# EAGLE design TinyCube10_BetterLib (EAGLE 7.5.0)
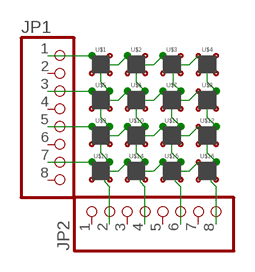
[diagram p0: schematic, sheet 1]

## Parts
JP1  PINHD-1X8BIG  [1X08-BIG]
JP2  PINHD-1X8BIG  [1X08-BIG]
U$1  PILLAR  [10MIL]
U$2  PILLAR  [10MIL]
U$3  PILLAR  [10MIL]
U$4  PILLAR  [10MIL]
U$5  PILLAR  [10MIL]
U$6  PILLAR  [10MIL]
U$7  PILLAR  [10MIL]
U$8  PILLAR  [10MIL]
U$9  PILLAR  [10MIL]
U$10  PILLAR  [10MIL]
U$11  PILLAR  [10MIL]
U$12  PILLAR  [10MIL]
U$13  PILLAR  [10MIL]
U$14  PILLAR  [10MIL]
U$15  PILLAR  [10MIL]
U$16  PILLAR  [10MIL]

## Nets
N$1: JP1.1 U$1.B U$2.B U$3.B U$4.B
N$4: JP1.7 U$13.B U$14.B U$15.B U$16.B
N$5: JP2.2 U$1.G U$5.G U$9.G U$13.G
N$6: JP2.4 U$2.G U$6.G U$10.G U$14.G
N$7: JP2.6 U$3.G U$7.G U$11.G U$15.G
N$8: JP2.8 U$4.G U$8.G U$12.G U$16.G
N$11: JP1.5 U$9.B U$10.B U$11.B U$12.B
N$26: JP1.3 U$5.B U$6.B U$7.B U$8.B
Unconnected: JP1.2 JP1.4 JP1.6 JP1.8 JP2.1 JP2.3 JP2.5 JP2.7 U$1.A U$1.R U$2.A U$2.R U$3.A U$3.R U$4.A U$4.R U$5.A U$5.R U$6.A U$6.R U$7.A U$7.R U$8.A U$8.R U$9.A U$9.R U$10.A U$10.R U$11.A U$11.R U$12.A U$12.R U$13.A U$13.R U$14.A U$14.R U$15.A U$15.R U$16.A U$16.R

## Library data of the parts
JP1 JP2 = adafruit:PINHD-1X8: PIN HEADER
U$1-U$16 = PILLAR:PILLAR

## Board
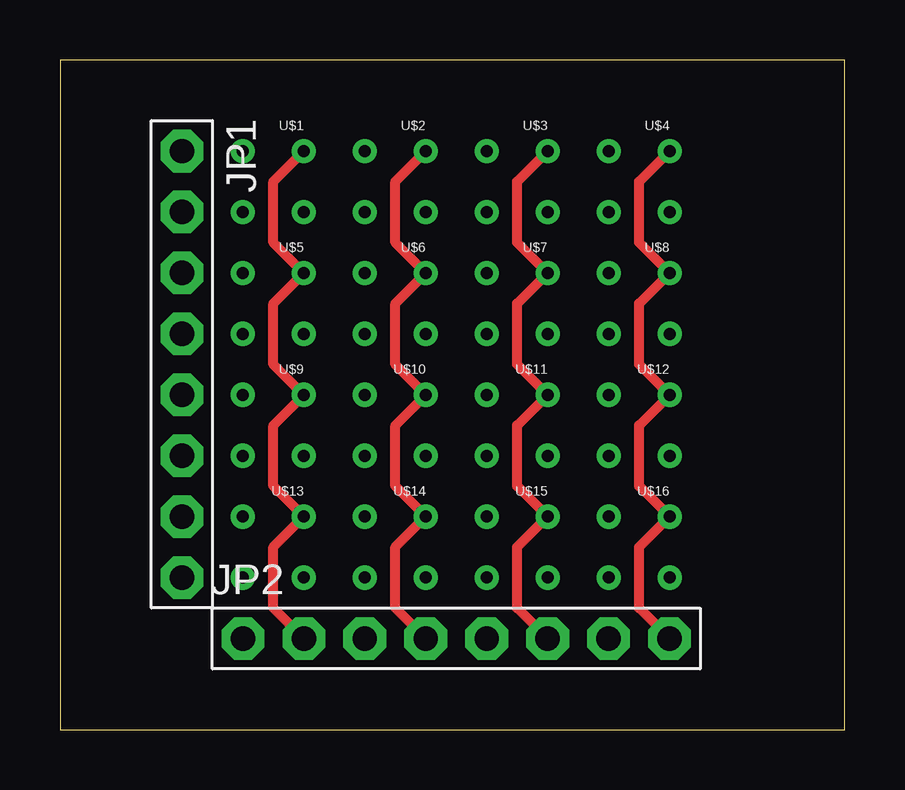
[diagram p1: board, top side]
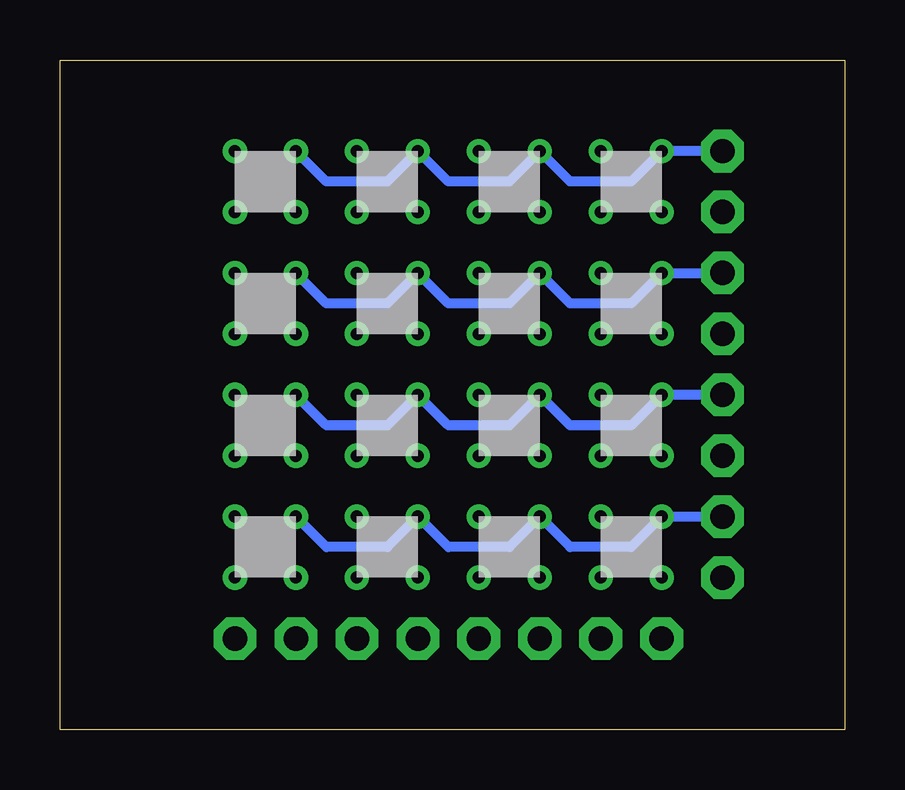
[diagram p2: board, bottom side, seen from below]

Size 32.69 x 27.93 mm. Coordinates in mm from the lower left corner, seen from the top.
Outline: 0,0 32.69,0 32.69,27.93 0,27.93 0,0
Copper layers (1*16): Top 0.035mm / dielectric 1.5mm / Bottom 0.035mm
Design rules "default": minimum track width 10mil, minimum drill 24mil, track to track 8mil, track to pad 8mil, pad to pad 8mil, via to via 8mil, smd to smd 8mil, copper to edge 40mil, drill to drill 8mil, minimum pad ring 10mil, minimum via ring 8mil, stop-mask expansion 4mil, vias tented up to drill 0mil, thermal gap 10mil

### Footprints (pad centres in the part's own frame; a part is rotated, then mirrored left to right if it is on the bottom)
1X08-BIG = drill 1.016 pad 1.778 octagon: 1 -8.89,0; 2 -6.35,0; 3 -3.81,0; 4 -1.27,0; 5 1.27,0; 6 3.81,0; 7 6.35,0; 8 8.89,0
10MIL = drill 0.5: A -1.27,-1.27; B -1.27,1.27; G 1.27,1.27; R 1.27,-1.27

### Placement (x,y rotation side)
JP1  5.08,15.24 270 top
JP2  16.51,3.81 0 top
U$1  8.89,22.86 0 top
U$2  13.97,22.86 0 top
U$3  19.05,22.86 0 top
U$4  24.13,22.86 0 top
U$5  8.89,17.78 0 top
U$6  13.97,17.78 0 top
U$7  19.05,17.78 0 top
U$8  24.13,17.78 0 top
U$9  8.89,12.7 0 top
U$10  13.97,12.7 0 top
U$11  19.05,12.7 0 top
U$12  24.13,12.7 0 top
U$13  8.89,7.62 0 top
U$14  13.97,7.62 0 top
U$15  19.05,7.62 0 top
U$16  24.13,7.62 0 top

### Tracks (layer width: path | path; a pad name or v marks a point on that pad's centre or on a via)
N$1
  Bottom 0.406: JP1.1 U$1.B 8.89,22.86 11.43,22.86 U$2.B 13.97,22.86 16.51,22.86 U$3.B 19.05,22.86 21.59,22.86 U$4.B
N$4
  Bottom 0.406: JP1.7 U$13.B 8.89,7.62 11.43,7.62 U$14.B 13.97,7.62 16.51,7.62 U$15.B 19.05,7.62 21.59,7.62 U$16.B
N$5
  Top 0.406: JP2.2 8.89,5.08 8.89,7.62 U$13.G 8.89,10.16 8.89,12.7 U$9.G 8.89,15.24 8.89,17.78 U$5.G 8.89,20.32 8.89,22.86 U$1.G
N$6
  Top 0.406: JP2.4 13.97,5.08 13.97,7.62 U$14.G 13.97,10.16 13.97,12.7 U$10.G 13.97,15.24 13.97,17.78 U$6.G 13.97,20.32 13.97,22.86 U$2.G
N$7
  Top 0.406: JP2.6 19.05,5.08 19.05,7.62 U$15.G 19.05,10.16 19.05,12.7 U$11.G 19.05,15.24 19.05,17.78 U$7.G 19.05,20.32 19.05,22.86 U$3.G
N$8
  Top 0.406: JP2.8 24.13,5.08 24.13,7.62 U$16.G 24.13,10.16 24.13,12.7 U$12.G 24.13,15.24 24.13,17.78 U$8.G 24.13,20.32 24.13,22.86 U$4.G
N$11
  Bottom 0.406: JP1.5 U$9.B 8.89,12.7 11.43,12.7 U$10.B 13.97,12.7 16.51,12.7 U$11.B 19.05,12.7 21.59,12.7 U$12.B
N$26
  Bottom 0.406: JP1.3 U$5.B 8.89,17.78 11.43,17.78 U$6.B 13.97,17.78 16.51,17.78 U$7.B 19.05,17.78 21.59,17.78 U$8.B